# Altium schematic sheet POWER.SchDoc
size A4
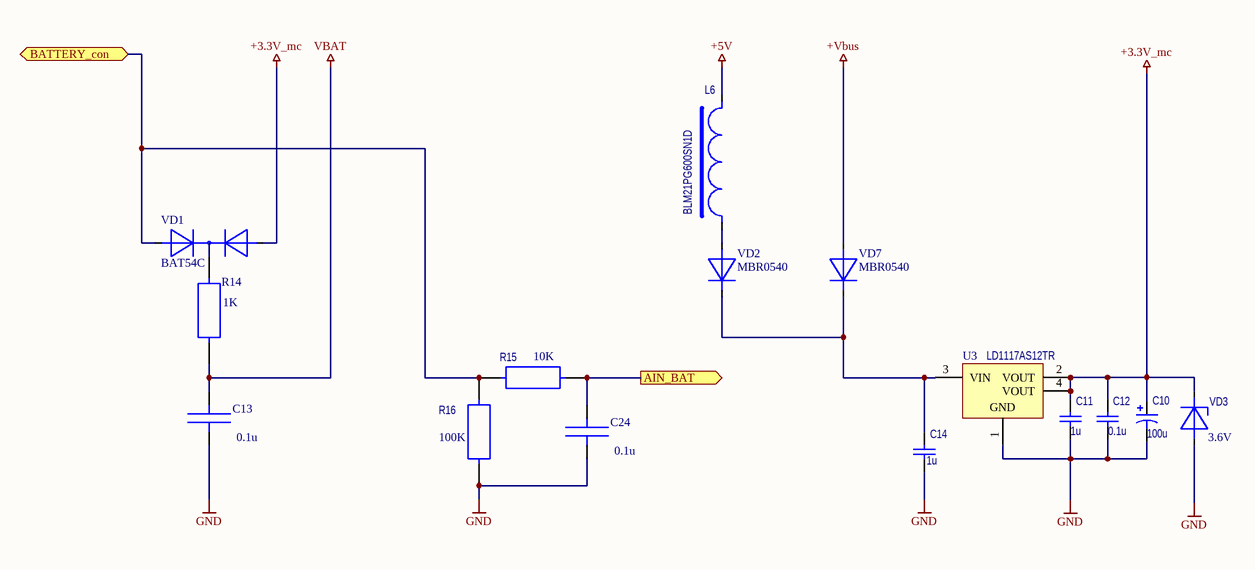
[diagram p0: POWER.SchDoc]

## Parts
C10  value 100u  [CAP 5X...Х2]  (hidden comment: 100u 6.3V)
C11  1u  [1206C]
C12  0.1u  [0603C]
C13  0.1u  [0603C]
C14  1u  [0603C]
C24  0.1u  [0603C]
L6  BLM21PG600SN1D  [0805]
R14  1K  [0603R]
R15  10K  [0603R]
R16  100K  [0603R]
U3  LD1117AS12TR  [SOT223]
VD1  BAT54C  [SOT95P230X110-3L]
VD2  MBR0540  [SOD123]
VD3  value 3.6V  [SOT23_1DIODE]  (hidden comment: BZX84C3V6)
VD7  MBR0540  [SOD123]

## Ports
AIN_BAT (out), BATTERY_con

## Nets
+3.3V_mc: C10.1 C11.2 C12.2 U3.2(VOUT) U3.4(VOUT) VD1.1(A1) VD3.K
+5V: L6.2
+Vbus: VD7.A
GND: C10.2 C11.1 C12.1 C13.2 C14.1 C24.2 R16.1 U3.1(GND) VD3.A
VBAT: C13.1 R14.2
AIN_BAT: C24.1 R15.1 ; port AIN_BAT
BATTERY_con: R15.2 R16.2 VD1.2(A2) ; port BATTERY_con
NetC14_2: C14.2 U3.3(VIN) VD2.K VD7.K
NetL6_1: L6.1 VD2.A
NetR14_1: R14.1 VD1.3(K)

## Library data of the parts
C10 = Cap Pol1: Polarized Capacitor (Radial); Published: 8-Jun-2000; LatestRevisionDate: 17-Jul-2002; LatestRevisionNote: Re-released for DXP Platform.; PackageReference: RB7.6-15; Publisher: Altium Limited
C11 C12 C14 = Cap: Capacitor; Published: 8-Jun-2000; LatestRevisionDate: 17-Jul-2002; LatestRevisionNote: Re-released for DXP Platform.; PackageReference: RAD-0.3; Publisher: Altium Limited
  C11 C14: Value: 1u
  C12: Value: 0.1u
C13 C24 = CAP: Конденсатор обыкновенный; Part Name: C-0603Y5V-104-20% (50v); Value: 0.1u
L6 = INDUCTOR_: Индуктивность
R14 = RES: Резистор обыкновенный; Part Name: R-0603-270R-5; Value: 1K
R15 R16 = RES: Резистор обыкновенный
  R15: Value: 10K
  R16: Value: 100K
U3 = LD1117AS12TR: 1A, Low Drop Positive Voltage Regulator, 1.2V, 4-Pin SOT-223, Tape and Reel; DatasheetVersion: Dec-2011; PackageVersion: 2010; PackageReference: SOT-223; PackageDescription: 4-Pin SOT-223 Package, 6.5 x 3.5 mm Body, 2.3 mm Pitch, 7 mm Lead Span; PartNumber: LD1117AS12TR; ComponentLink1Description: Manufacturer URL; ComponentLink1URL: http://www.st.com; ComponentLink2Description: Datasheet; ComponentLink2URL: http://www.st.com/internet/com/TECHNICAL_RESOURCES/TECHNICAL_LITERATURE/DATASHEET/CD00002116.pdf
VD1 = DIODE_PAIR_C: диодная сборка(общий катод); Part Name: BAT54C
VD2 VD7 = DIODE: Диод
VD3 = ZENNER: Стабилитрон